# EAGLE design MotherBoard (EAGLE 6.2)
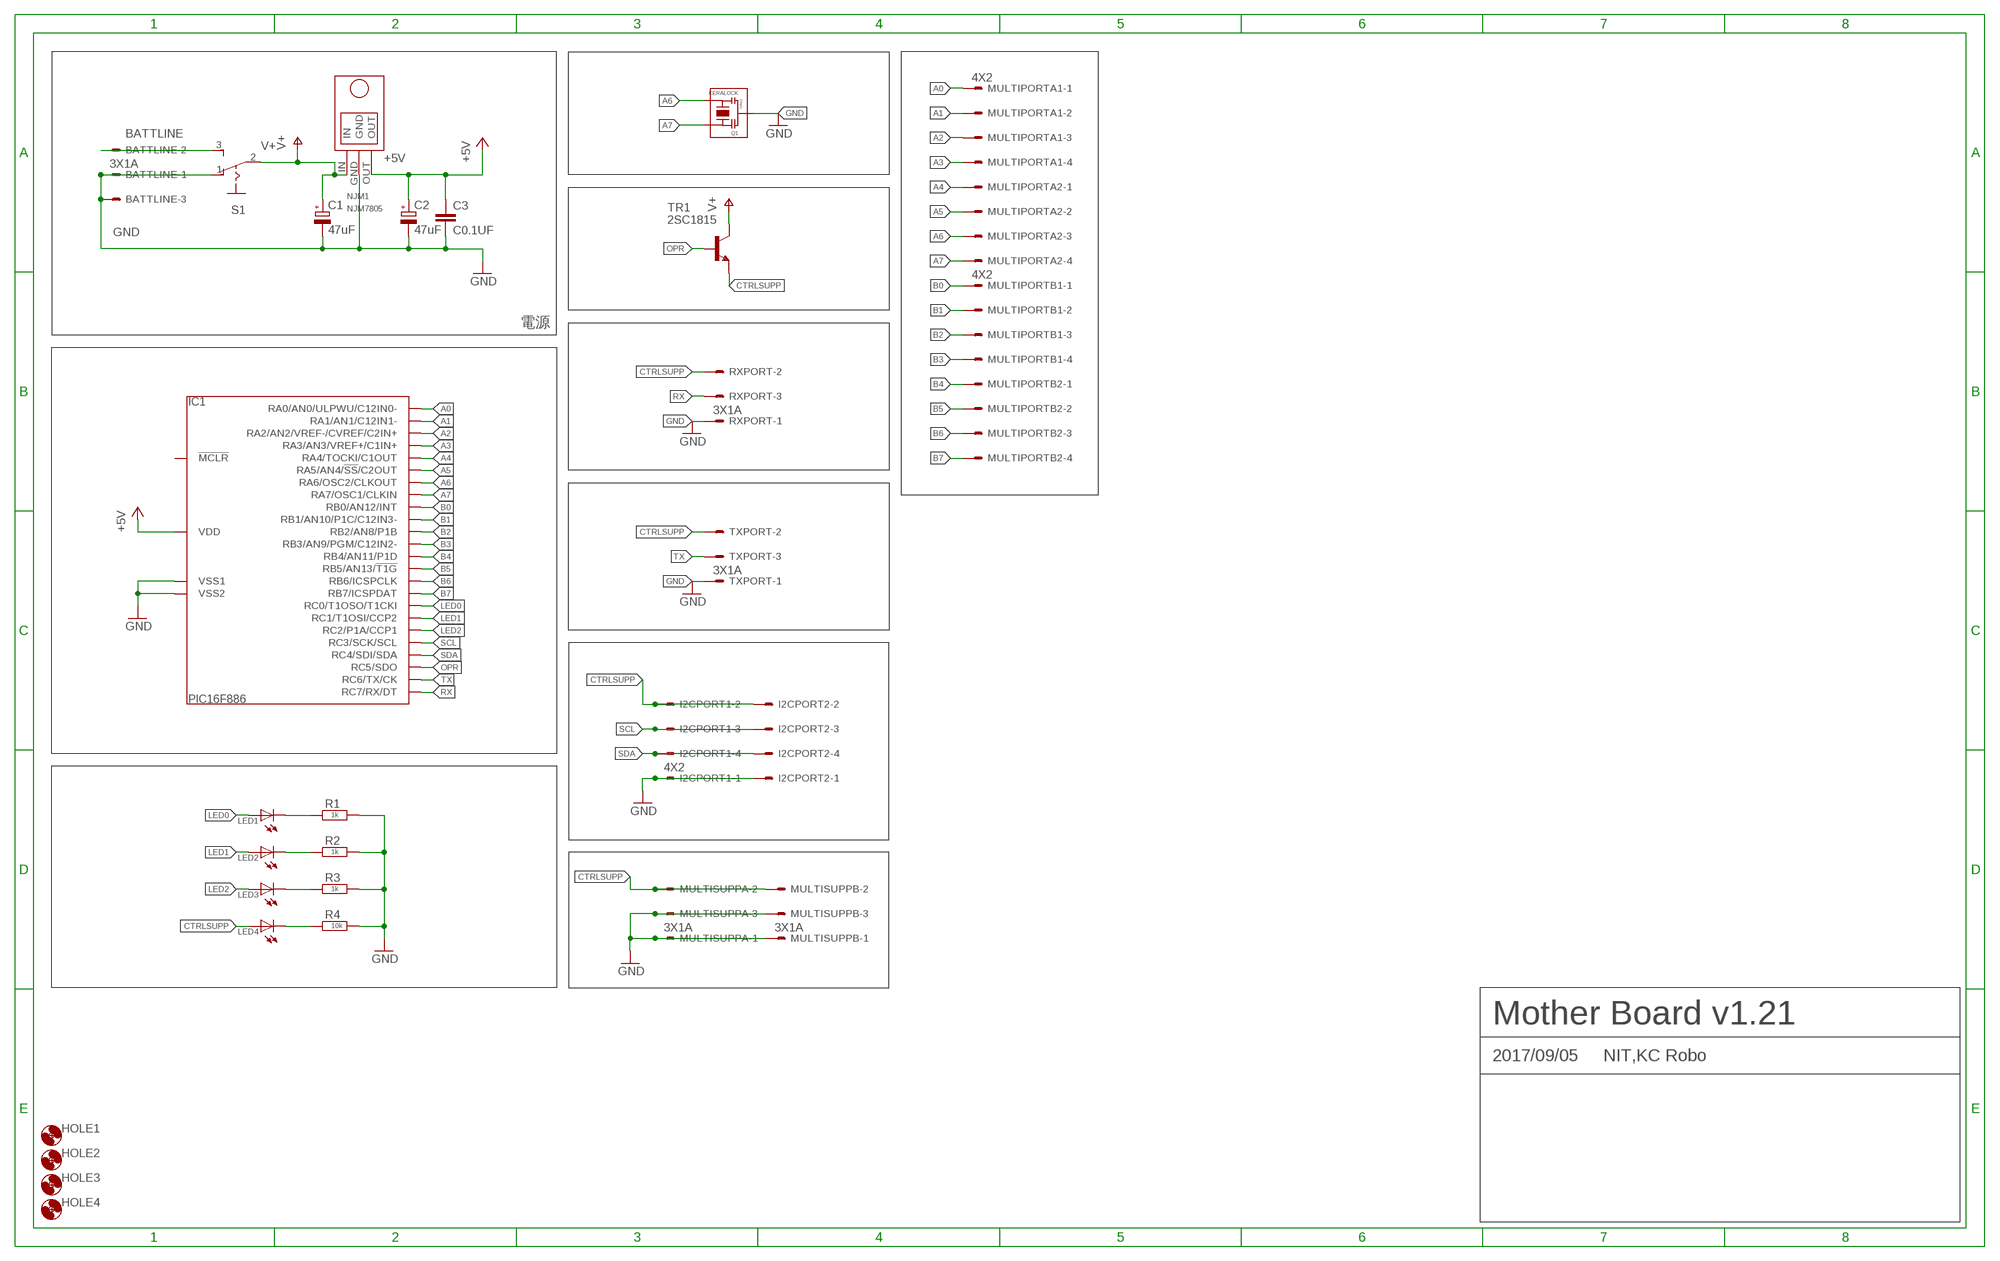
[diagram p0: schematic, sheet 1]

## Parts
BATTLINE  3X1A  [37203-62A3-003]
C1  47uF  CPOL-EU2-5MM  [E2-5]
C2  47uF  CPOL-EU2-5MM  [E2-5]
C3  C0.1UF  [C0.1UF]
HOLE1  HOLE3.3M3BOLT  [HOLE3.3]
HOLE2  HOLE3.3M3BOLT  [HOLE3.3]
HOLE3  HOLE3.3M3BOLT  [HOLE3.3]
HOLE4  HOLE3.3M3BOLT  [HOLE3.3]
I2CPORT  4X2  [37208-62A3-004]
IC1  PIC16F886  [DIL28]
LED1  LED5MM  [LED5MM]
LED2  LED5MM  [LED5MM]
LED3  LED5MM  [LED5MM]
LED4  LED5MM  [LED5MM]
MULTIPORTA  4X2  [37208-62A3-004]
MULTIPORTB  4X2  [37208-62A3-004]
MULTISUPPA  3X1A  [37203-62A3-003]
MULTISUPPB  3X1A  [37203-62A3-003]
NJM1  NJM7805  [NJM7805]
Q1  CERALOCK  [CERALOCK]
R1  1k  R-EU_R3216W  [R3216W]
R2  1k  R-EU_R3216W  [R3216W]
R3  1k  R-EU_R3216W  [R3216W]
R4  10k  R-EU_R3216W  [R3216W]
RXPORT  3X1A  [37203-62A3-003]
S1  SLIDESW  [SLIDESW]
TR1  2SC1815  [TO92-]
TXPORT  3X1A  [37203-62A3-003]

## Nets
+5V: C2.+ C3.1 IC1.20(VDD) NJM1.OUT
A0: IC1.2(RA0/AN0/ULPWU/C12IN0-) MULTIPORTA.1-1
A1: IC1.3(RA1/AN1/C12IN1-) MULTIPORTA.1-2
A2: IC1.4(RA2/AN2/VREF-/CVREF/C2IN+) MULTIPORTA.1-3
A3: IC1.5(RA3/AN3/VREF+/C1IN+) MULTIPORTA.1-4
A4: IC1.6(RA4/TOCKI/C1OUT) MULTIPORTA.2-1
A5: IC1.7(RA5/AN4/!SS!/C2OUT) MULTIPORTA.2-2
A6: IC1.10(RA6/OSC2/CLKOUT) MULTIPORTA.2-3 Q1.P$3
A7: IC1.9(RA7/OSC1/CLKIN) MULTIPORTA.2-4 Q1.P$1
B0: IC1.21(RB0/AN12/INT) MULTIPORTB.1-1
B1: IC1.22(RB1/AN10/P1C/C12IN3-) MULTIPORTB.1-2
B2: IC1.23(RB2/AN8/P1B) MULTIPORTB.1-3
B3: IC1.24(RB3/AN9/PGM/C12IN2-) MULTIPORTB.1-4
B4: IC1.25(RB4/AN11/P1D) MULTIPORTB.2-1
B5: IC1.26(RB5/AN13/!T1G) MULTIPORTB.2-2
B6: IC1.27(RB6/ICSPCLK) MULTIPORTB.2-3
B7: IC1.28(RB7/ICSPDAT) MULTIPORTB.2-4
BATTLINE: BATTLINE.1-2 S1.3
CTRLSUPP: I2CPORT.1-2 I2CPORT.2-2 LED4.A MULTISUPPA.1-2 MULTISUPPB.1-2 RXPORT.1-2 TR1.E TXPORT.1-2
GND: BATTLINE.1-1 BATTLINE.1-3 C1.- C2.- C3.2 I2CPORT.1-1 I2CPORT.2-1 IC1.8(VSS1) IC1.19(VSS2) MULTISUPPA.1-1 MULTISUPPA.1-3 MULTISUPPB.1-1 MULTISUPPB.1-3 NJM1.GND Q1.P$2 R1.2 R2.2 R3.2 R4.2 RXPORT.1-1 S1.1 TXPORT.1-1
LED0: IC1.11(RC0/T1OSO/T1CKI) LED1.A
LED1: IC1.12(RC1/T1OSI/CCP2) LED2.A
LED2: IC1.13(RC2/P1A/CCP1) LED3.A
N$1: LED1.K(C) R1.1
N$2: LED2.K(C) R2.1
N$3: LED3.K(C) R3.1
N$6: LED4.K(C) R4.1
OPR: IC1.16(RC5/SDO) TR1.B
RX: IC1.18(RC7/RX/DT) RXPORT.1-3
SCL: I2CPORT.1-3 I2CPORT.2-3 IC1.14(RC3/SCK/SCL)
SDA: I2CPORT.1-4 I2CPORT.2-4 IC1.15(RC4/SDI/SDA)
TX: IC1.17(RC6/TX/CK) TXPORT.1-3
V+: C1.+ NJM1.IN S1.2 TR1.C
Unconnected: IC1.1(!MCLR)

## Notes on the sheet
- 電源
- Mother Board v1.21
- 2017/09/05 | NIT,KC Robo

## Library data of the parts
BATTLINE MULTISUPPA MULTISUPPB RXPORT TXPORT = 3M_372xx:3X1
C1 C2 = FP-21T for MITS:CPOL-EU2
C3 = FP-21T for MITS:C0.1UF
HOLE1-HOLE4 = Hole:HOLE3.3
I2CPORT MULTIPORTA MULTIPORTB = 3M_372xx:4X2
IC1 = PIC:PIC16F886
LED1-LED4 = FP-21T for MITS:LED: LED OSRAM: - CHIPLED LG R971, LG N971, LY N971, LG Q971, LY Q971, LO R971, LY R971 LH N974, LH R974 LS Q976, LO Q976, LY Q976 LO Q996 - Hyper CHIPLED LW Q18S LB Q993, LB Q99A, LB R99A - SideLED LS A670, LO A670, LY A670, LG A670, LP A670 LB A673, LV A673, LT A673, LW A673 LH A674 LY A675 LS A676, LA A676, LO A676, LY A676, LW A676 LS A679, LY A679, LG A679 - Hyper Micro SIDELED® LS Y876, LA Y876, LO Y876, LY Y876 LT Y87S - SmartLED LW L88C, LW L88S LB L89C, LB L89S, LG L890 LS L89K, LO L89K, LY L89K LS L896, LA L896, LO L896, LY L896 - TOPLED LS T670, LO T670, LY T670, LG T670, LP T670 LSG T670, LSP T670, LSY T670, LOP T670, LYG T670 LG T671, LOG T671, LSG T671 LB T673, LV T673, LT T673, LW T673 LH T674 LS T676, LA T676, LO T676, LY T676, LB T676, LH T676, LSB T676, LW T676 LB T67C, LV T67C, LT T67C, LS T67K, LO T67K, LY T67K, LW E67C LS E67B, LA E67B, LO E67B, LY E67B, LB E67C, LV E67C, LT E67C LW T67C LS T679, LY T679, LG T679 LS T770, LO T770, LY T770, LG T770, LP T770 LB T773, LV T773, LT T773, LW T773 LH T774 LS E675, LA E675, LY E675, LS T675 LS T776, LA T776, LO T776, LY T776, LB T776 LHGB T686 LT T68C, LB T68C - Hyper Mini TOPLED® LB M676 - Mini TOPLED Santana® LG M470 LS M47K, LO M47K, LY M47K Source: http://www.osram.convergy.de - LUMILED® LXK2-PW12-R00, LXK2-PW12-S00, LXK2-PW14-U00, LXK2-PW14-V00 LXK2-PM12-R00, LXK2-PM12-S00, LXK2-PM14-U00 LXK2-PE12-Q00, LXK2-PE12-R00, LXK2-PE12-S00, LXK2-PE14-T00, LXK2-PE14-U00 LXK2-PB12-K00, LXK2-PB12-L00, LXK2-PB12-M00, LXK2-PB14-N00, LXK2-PB14-P00, LXK2-PB14-Q00 LXK2-PR12-L00, LXK2-PR12-M00, LXK2-PR14-Q00, LXK2-PR14-R00 LXK2-PD12-Q00, LXK2-PD12-R00, LXK2-PD12-S00 LXK2-PH12-R00, LXK2-PH12-S00 LXK2-PL12-P00, LXK2-PL12-Q00, LXK2-PL12-R00 Source: www.luxeon.com
NJM1 = My_NJM7805:NJM7805
Q1 = FP-21T for MITS:CERALOCK: CERALOCK CERAMIC RESONATOR
R1-R4 = rcl:R-EU_: RESISTOR, European symbol
S1 = switch:SLIDESW
TR1 = FP-21T for MITS:2SC1815

## Board
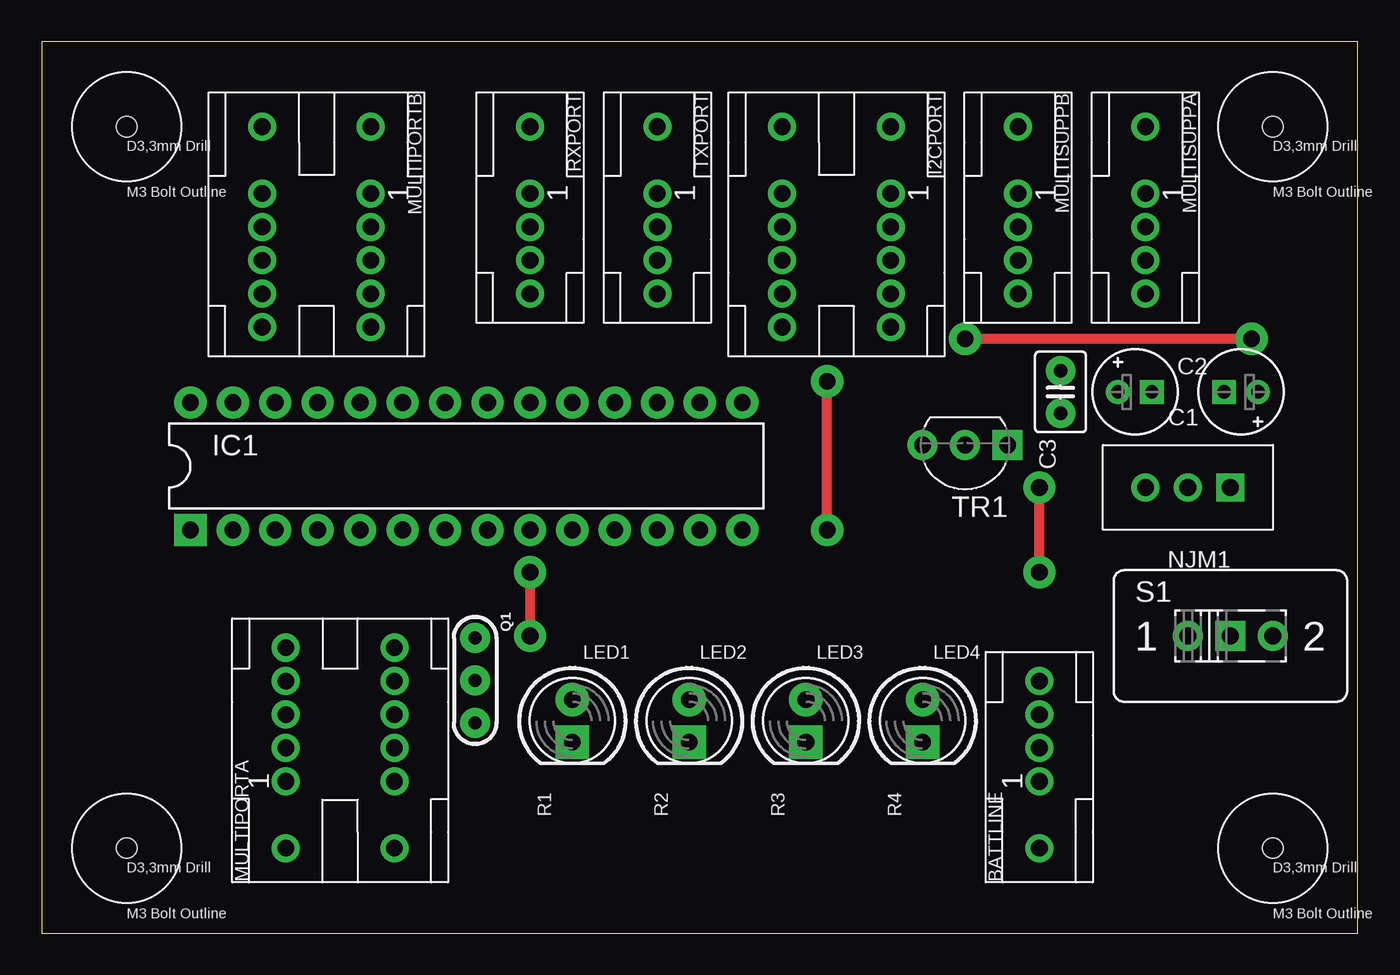
[diagram p1: board, top side]
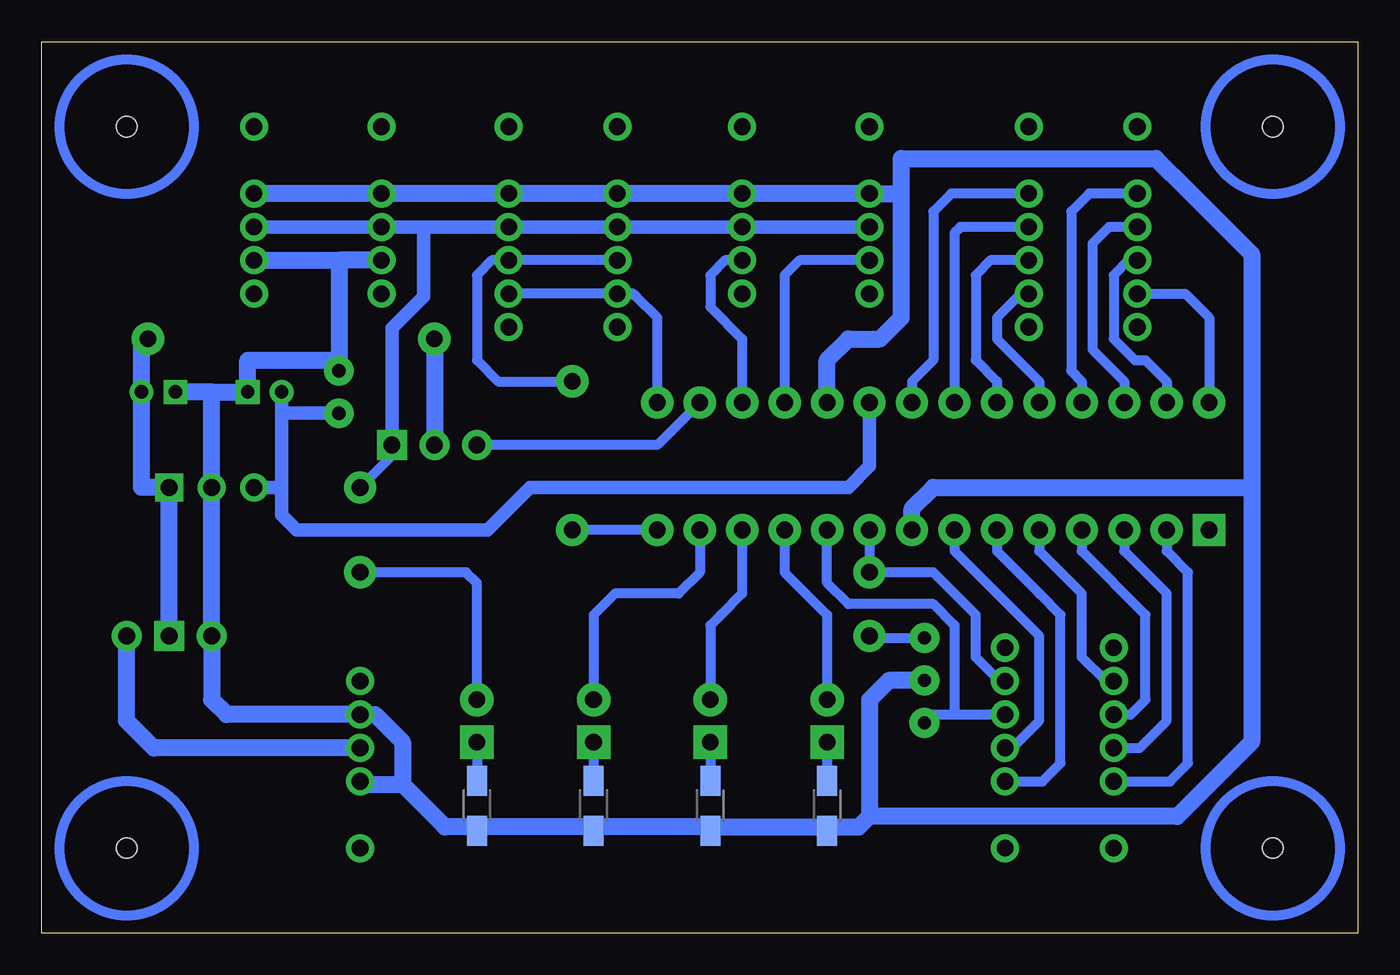
[diagram p2: board, bottom side, seen from below]

Size 78.74 x 53.34 mm. Coordinates in mm from the lower left corner, seen from the top.
Outline: 0,0 78.74,0 78.74,53.34 0,53.34 0,0
Copper layers (1*16): Top 0.035mm / dielectric 1.5mm / Bottom 0.035mm
Design rules: minimum track width 0.15mm, minimum drill 0.3mm, track to track 0.25mm, track to pad 0.25mm, pad to pad 0.25mm, via to via 0.25mm, smd to smd 0.2mm, copper to edge 100mil, drill to drill 0.45mm, minimum pad ring 0.15mm, minimum via ring 0.15mm, stop-mask expansion 4mil, vias tented up to drill 0mil, thermal gap 0.15mm

### Footprints (pad centres in the part's own frame; a part is rotated, then mirrored left to right if it is on the bottom)
37203-62A3-003 = drill 1 pad 1.676: 1-1 0,4; 1-2 0,6; 1-3 0,8; P$1 0,0; P$2 0,10
E2-5 = drill 0.8 pad 1.422: + -1.016,0 | drill 0.8 pad 1.422 square: - 1.016,0
C0.1UF = drill 0.8 pad 1.778: 1 -1.27,0; 2 1.27,0
HOLE3.3 = hole 1.2: 0,0
37208-62A3-004 = drill 1 pad 1.676: 1-1 0,4; 1-2 0,6; 1-3 0,8; 1-4 0,10; 2-1 6.5,4; 2-2 6.5,6; 2-3 6.5,8; 2-4 6.5,10; P$1 0,0; P$2 0,12; P$3 6.5,0; P$4 6.5,12
DIL28 = drill 1 pad 1.93 square: 1 -16.51,-3.81 | drill 1 pad 1.93: 2 -13.97,-3.81; 3 -11.43,-3.81; 4 -8.89,-3.81; 5 -6.35,-3.81; 6 -3.81,-3.81; 7 -1.27,-3.81; 8 1.27,-3.81; 9 3.81,-3.81; 10 6.35,-3.81; 11 8.89,-3.81; 12 11.43,-3.81; 13 13.97,-3.81; 14 16.51,-3.81; 15 16.51,3.81; 16 13.97,3.81; 17 11.43,3.81; 18 8.89,3.81; 19 6.35,3.81; 20 3.81,3.81; 21 1.27,3.81; 22 -1.27,3.81; 23 -3.81,3.81; 24 -6.35,3.81; 25 -8.89,3.81; 26 -11.43,3.81; 27 -13.97,3.81; 28 -16.51,3.81
LED5MM = drill 1 pad 2: A -1.27,0 | drill 1 pad 2 square: K 1.27,0
NJM7805 = drill 1 pad 1.676: GND 0,0; OUT 2.54,0 | drill 1 pad 1.676 square: IN -2.54,0
CERALOCK = drill 0.8 pad 1.778: P$1 -2.54,0; P$2 0,0; P$3 2.54,0
R3216W = smd 1.8 x 1.2: 1 -1.499,0; 2 1.499,0
SLIDESW = drill 1 pad 1.8: 1 -2.54,0; 3 2.54,0 | drill 1 pad 1.8 square: 2 0,0
TO92- = drill 1 pad 1.8: B 2.54,0; C 0,0 | drill 1 pad 1.8 square: E -2.54,0

### Placement (x,y rotation side)
BATTLINE  59.69,5.08 0 top
C1  71.75,32.38 180 top
C2  65.41,32.38 0 top
C3  60.96,32.38 90 top
HOLE1  5.08,5.08 0 top
HOLE2  5.08,48.26 0 top
HOLE3  73.66,48.26 0 top
HOLE4  73.66,5.08 0 top
I2CPORT  50.8,48.26 180 top
IC1  25.4,27.94 0 top
LED1  31.75,12.7 270 top
LED2  38.73,12.7 270 top
LED3  45.72,12.7 270 top
LED4  52.7,12.7 270 top
MULTIPORTA  14.61,5.08 0 top
MULTIPORTB  19.68,48.26 180 top
MULTISUPPA  66.04,48.26 180 top
MULTISUPPB  58.42,48.26 180 top
NJM1  68.58,26.67 180 top
Q1  25.93,15.12 270 top
R1  31.75,7.62 270 bottom
R2  38.73,7.62 270 bottom
R3  45.72,7.62 270 bottom
R4  52.7,7.62 270 bottom
RXPORT  29.21,48.26 180 top
S1  71.12,17.78 0 top
TR1  55.24,29.21 180 top
TXPORT  36.83,48.26 180 top

### Tracks (layer width: path | path; a pad name or v marks a point on that pad's centre or on a via)
+5V
  Bottom 0.813: NJM1.OUT 64.39,26.67 | 64.39,26.67 C2.+ 64.39,31.11 C3.1 | IC1.20 29.21,27.94 30.48,26.67 49.53,26.67 52.07,24.13 63.5,24.13 64.39,25.02 64.39,26.67
A0
  Bottom 0.61: IC1.2 11.43,22.86 10.16,21.59 10.16,10.16 11.24,9.08 MULTIPORTA.1-1
A1
  Bottom 0.61: IC1.3 13.97,22.86 11.43,20.32 11.43,12.7 13.05,11.08 MULTIPORTA.1-2
A2
  Bottom 0.61: IC1.4 16.51,22.86 12.7,19.05 12.7,13.97 13.59,13.08 MULTIPORTA.1-3
A3
  Bottom 0.61: IC1.5 19.05,22.86 16.51,20.32 16.51,16.51 15.08,15.08 MULTIPORTA.1-4
A4
  Bottom 0.61: IC1.6 21.59,22.86 19.05,20.32 17.78,19.05 17.78,10.16 18.86,9.08 MULTIPORTA.2-1
A5
  Bottom 0.61: IC1.7 24.13,22.86 19.05,17.78 19.05,12.7 20.67,11.08 MULTIPORTA.2-2
A6
  Bottom 0.61: 21.97,13.08 MULTIPORTA.2-3 24.13,13.08 | IC1.10 31.75,20.95 30.48,19.68 25.4,19.68 24.13,18.41 24.13,13.08 | Q1.P$3 25.43,13.08 24.13,13.08
A7  (via drill 1 pad 1.93)
  Top 0.61: v29.21,21.59 v29.21,17.78
  Bottom 0.61: MULTIPORTA.2-4 21.43,15.08 22.86,16.51 22.86,17.78 | 22.86,17.78 22.86,19.05 25.4,21.59 v29.21,21.59 IC1.9 | 22.86,17.66 22.86,17.78 | v29.21,17.78 29.09,17.66 Q1.P$1
B0
  Bottom 0.61: MULTIPORTB.1-1 24.32,44.26 25.4,43.18 25.4,34.29 26.67,33.02 IC1.21
B1
  Bottom 0.61: MULTIPORTB.1-2 23.78,42.26 24.13,41.91 IC1.22
B2
  Bottom 0.61: MULTIPORTB.1-3 21.97,40.26 22.86,39.37 22.86,34.29 21.59,33.02 IC1.23
B3
  Bottom 0.61: MULTIPORTB.1-4 20.16,38.26 21.59,36.83 21.59,35.56 19.05,33.02 IC1.24
B4
  Bottom 0.61: MULTIPORTB.2-1 16.07,44.26 17.14,43.18 17.14,33.66 16.51,33.02 IC1.25
B5
  Bottom 0.61: MULTIPORTB.2-2 14.89,42.26 15.88,41.27 15.88,34.92 13.97,33.02 IC1.26
B6
  Bottom 0.61: MULTIPORTB.2-3 13.71,40.26 14.61,39.37 14.61,35.56 13.34,34.29 12.7,34.29 11.43,33.02 IC1.27
B7
  Bottom 0.61: MULTIPORTB.2-4 10.32,38.26 8.89,36.83 IC1.28
BATTLINE
  Bottom 1.016: BATTLINE.1-2 72.04,11.08 73.66,12.7 S1.3
CTRLSUPP  (via drill 1 pad 1.93)
  Top 0.61: v59.69,21.59 v59.69,26.67
  Bottom 0.61: TR1.E 57.78,28.57 v59.69,26.67 | LED4.A 52.7,20.95 53.34,21.59 v59.69,21.59
  Bottom 0.813: MULTISUPPA.1-2 MULTISUPPB.1-2 55.88,42.26 | TR1.E 57.78,36.2 55.88,38.1 55.88,41.91 | RXPORT.1-2 TXPORT.1-2 I2CPORT.2-2 I2CPORT.1-2 55.88,42.26 | 55.88,42.26 55.88,41.91 | 55.88,42.26 55.88,41.91
GND
  Bottom 1.016: MULTISUPPA.1-1 MULTISUPPB.1-1 I2CPORT.1-1 I2CPORT.2-1 TXPORT.1-1 RXPORT.1-1 27.3,44.26 | NJM1.GND 68.58,32.38 | 68.58,32.38 C1.- | NJM1.GND 68.58,32.38 | 68.58,32.38 C2.- 66.42,34.29 60.96,34.29 | C3.2 60.96,34.29 | NJM1.GND S1.1 68.58,13.97 67.69,13.08 BATTLINE.1-3 58.8,13.08 57.15,11.43 57.15,8.89 | BATTLINE.1-1 59.5,8.89 57.15,8.89 | 57.15,8.89 54.61,6.35 52.7,6.35 | 38.73,6.35 31.75,6.35 | 31.75,6.35 29.84,6.35 29.21,6.99 | 38.73,6.35 45.72,6.35 | 45.72,6.35 52.7,6.35 | R4.2 52.7,6.35 | R1.2 31.75,6.35 | R2.2 38.73,6.35 | R3.2 45.72,6.35 | IC1.19 31.75,34.29 30.48,35.56 28.57,35.56 27.3,36.83 27.3,44.26 | 27.3,44.26 27.3,46.35 12.06,46.35 10.16,44.45 6.35,40.64 6.35,26.67 | 6.35,26.67 6.35,11.43 10.79,6.99 29.21,6.99 | Q1.P$2 28.06,15.12 29.21,13.97 29.21,6.99 | IC1.8 26.67,25.4 25.4,26.67 6.35,26.67 | MULTISUPPB.1-3 60.96,40.26 | 60.96,40.26 60.96,34.29 | MULTISUPPA.1-3 60.96,40.26
LED0
  Bottom 0.61: IC1.11 34.29,21.59 31.75,19.05 LED1.A
LED1
  Bottom 0.61: IC1.12 36.83,20.32 38.1,19.05 38.73,18.41 LED2.A
LED2
  Bottom 0.61: IC1.13 39.37,21.59 40.64,20.32 44.45,20.32 45.72,19.05 LED3.A
N$1
  Bottom 0.61: LED1.K R1.1
N$2
  Bottom 0.61: LED2.K R2.1
N$3
  Bottom 0.61: LED3.K R3.1
N$6
  Bottom 0.61: LED4.K R4.1
OPR
  Bottom 0.61: IC1.16 41.91,29.21 TR1.B
RX
  Bottom 0.61: RXPORT.1-3 33.4,40.26 34.29,39.37 IC1.18
SCL  (via drill 1 pad 1.93)
  Top 0.61: v46.99,24.13 v46.99,33.02
  Bottom 0.61: I2CPORT.2-3 I2CPORT.1-3 51.81,40.26 52.7,39.37 52.7,34.29 51.44,33.02 v46.99,33.02 | IC1.14 v46.99,24.13
SDA
  Bottom 0.61: I2CPORT.1-4 I2CPORT.2-4 43.34,38.26 43.18,38.1 41.91,36.83 IC1.15
TX
  Bottom 0.61: TXPORT.1-3 37.84,40.26 38.73,39.37 38.73,37.47 36.83,35.56 IC1.17
V+  (via drill 1 pad 1.93)
  Top 0.61: v72.39,35.56 v55.24,35.56
  Bottom 1.016: S1.2 NJM1.IN 72.77,26.67 C1.+ 72.77,35.56 v72.39,35.56 | v55.24,35.56 TR1.C